# Altium project Course_Work_LM317.PrjPcb
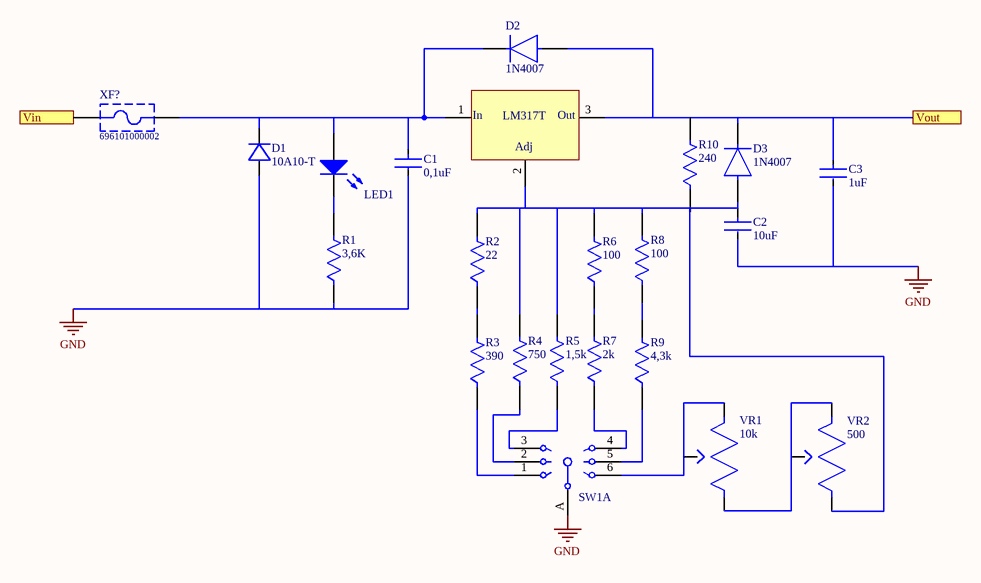
[diagram p0: Sheet1.SchDoc]
1 sheet, 22 parts. Net scope: flat (ports and power ports of the same name join across sheets).
Board file: PCB1.PcbDoc

## Sheet Sheet1.SchDoc
size A4

### Parts
*  LM317T  (value not drawn)
C1  0,1uF  [FP-CL31-IPC_C]
C2  10uF  [FP-CL31-IPC_C]
C3  1uF  [FP-CL31-IPC_B]
D1  10A10-T
D2  1N4007  [FP-1N4007-MFG]
D3  1N4007  [FP-1N4007-MFG]
LED1  150120GS75000  [1206_A]  (value not drawn)
R1  3,6K  [FP-CR1206-IPC_C]
R2  22  [FP-AC1206-MFG]
R3  390  [FP-AC1206-MFG]
R4  750  [FP-RT1206-MFG]
R5  1,5k  [FP-AC1206-MFG]
R6  100  [FP-RT1206-MFG]
R7  2k  [FP-RT1206-MFG]
R8  100  [FP-RT1206-MFG]
R9  4,3k  [FP-RT1206-MFG]
R10  240  [FP-AC1206-MFG]
SW1  A20615RNCQE  [CKCP-A20615RNCQ-14_V]  (value not drawn)  (part A of 2)
VR1  10k  [P160]
VR2  500  [P160]
XF?  696101000002  [696101000002]

### Ports
Vin (in), Vout (out)

### Nets
GND: SW1.A
NetXF?_1: XF?.1 ; port Vin

Not connected (* = marked no-connect by the designer): * 1(In) 2(Adj) 3(Out); C1 1 2; C2 1 2; C3 1 2; D1 0 1; D2 1(C) 2(A); D3 1(C) 2(A); LED1 1(K) 2(A); R1 1 2; R2 1 2; R3 1 2; R4 1 2; R5 1 2; R6 1 2; R7 1 2; R8 1 2; R9 1 2; R10 1 2; SW1 1 2 3 4 5 6; VR1 1 2 3; VR2 1 2 3; XF? 2

### Notes on the sheet
- Labels drawn without touching a wire or pin: GND

### Library data of the parts
* = LM317T: IC REG LIN POS ADJ 1.5A TO220AB; Manufacturer: ON Semiconductor / Fairchild; Number of Outputs: 1; Output Voltage: 37V; Polarity: Positive; Output Type: Adjustable; Max Input Voltage: 40V; Min Input Voltage: 4.2V; Min Output Voltage: 1.2V; Reference Voltage: 1.3V; Power Supply Rejection Ratio (PSRR): 60dB; Dropout Voltage: 2V; Power Rating: 20W; Supplier 1: Avnet; Manufacturer Part Number: LM317T; RoHS: Yes; Category: Voltage Regulators - Linear; Stock 1: 199474; Pricing 1: 331=1,07281, 340=1,05770, 670=1,02748, 1700=1,00482, 3400=0,96704, 17000=0,94438, 34000=0,92171 (USD); Mount: Through Hole; Case/Package: TO-220; Number of Pins: 3; Weight: 0.042823oz; Contact Plating: Tin,Matte; Min Operating Temperature: 0°C; Max Operating Temperature: 125°C; Output Current: 1.5A; Packaging: Rail/Tube; Max Output Current: 1.5A; Package Quantity: 50; Max Output Voltage: 37V; Number of Regulators: 1; Min Current Limit: 1.5A; Max Power Dissipation: 20W; Length: 10.67mm; Width: 4.83mm; Height: 9.4mm; Radiation Hardening: No; RoHS Compliant: Yes; REACH SVHC: No SVHC; Lead Free: Lead Free; ComponentLink1URL: https://datasheet.ciiva.com/4882/lm317-64104-4882145.pdf?src-supplier=Mouser; ComponentLink1Description: https://datasheet.ciiva.com/4882/lm317-64104-4882145.pdf?src-supplier=Mouser; ComponentLink2URL: https://datasheet.ciiva.com/2070/lm317-d-2070714.pdf?src-supplier=Digi-Key; ComponentLink2Description: https://datasheet.ciiva.com/2070/lm317-d-2070714.pdf?src-supplier=Digi-Key; Supplier Part Number 1: LM317T
C1 = CMP-13271-001731-1: Cap Ceramic 100nF 50V X7R ±10% SMD 1206 +125°C Embossed T/R; Voltage: 50V; Thickness: 0.037inch; Lead Free: Lead Free; Length: 3.2mm; Min Operating Temperature: -55°C; Package Quantity: 15000; Packaging: Tape and Reel; Mount: Surface Mount; Depth: 1.6mm; Case/Package: 1206; Voltage Rating (DC): 50V; Tolerance: 10%; Height: 0.85mm; Capacitance: 100nF; Radiation Hardening: No; Dielectric: X7R; Voltage Rating: 50V; Max Operating Temperature: 125°C; Width: 0.063inch
C2 = CMP-13271-000016-1: CAP CER 10UF 50V X5R 1206; Manufacturer: Samsung; Manufacturer Part Number: CL31A106KBHNNNE; Tolerance: 10%; Material: Ceramic; Temperature Coefficient: 15%; RoHS: TRUE; Ipc Land Pattern Name: CAPC320160X160; Temperature Range Low: -55°C; Value: 10uF; Device Class L3: Ceramic Capacitors; Category: Cap; Temperature Characteristic: X5R; Lead Free: Yes; Device Class L2: Capacitors; Octopart: https://octopart.com/cl31a106kbhnnne-samsung-19832778; ComponentLink2Description: Datasheet; Digikey Description: CAP CER 10UF 50V X5R 1206; Voltage: 50V; ComponentLink2URL: http://www.samsungsem.com/kr/support/product-search/mlcc/__icsFiles/afieldfile/2018/06/21/CL31A106KBHNNNE.pdf; Capacitance: 10uF; Temperature Range High: +85°C; Device Class L1: Passive Components; Height: 1.8mm; Automotive: No; Voltage Rating: 50V; Package: CL31; Temperature: -55°C to +85°C
C3 = CMP-13271-001662-1: Cap Ceramic 1uF 50V X7R ±10% SMD 1206 +125°C Embossed T/R; Case Code (Metric): 3216; Packaging: Tape and Reel; Depth: 1.6mm; Max Operating Temperature: 125°C; Length: 3.2mm; Contact Plating: Tin; Voltage Rating (DC): 50V; Radiation Hardening: No; Min Operating Temperature: -55°C; Dielectric: X7R; Voltage: 50V; Lead Free: Lead Free; Capacitance: 1uF; Package Quantity: 1; Material: Ceramic; Thickness: 0.071inch; Width: 0.063inch; Voltage Rating: 50V; Case Code (Imperial): 1206; Mount: Surface Mount; Case/Package: 1206; Tolerance: 10%; Height: 1.6mm
D1 = 10A10-T: Rectifiers Silicon Rectifier R6,10A,1000V; Manufacturer: Rectron; Element Configuration: Single; Max Surge Current: 400A; Max Reverse Current: 10uA; Reverse Voltage: 1kV; Forward Voltage: 1.1V; Supplier 1: Arrow Electronics; Manufacturer Part Number: 10A10-T; RoHS: Yes; Category: Rectifier Diodes; Stock 1: 2; Pricing 1: 1=0,32310, 800=0,36890, 6400=0,10300, 6400=0,10970 (USD); Case/Package: R; Weight: 0.074075oz; Min Operating Temperature: -55°C; Max Operating Temperature: 150°C; Packaging: Tape and Reel; Package Quantity: 800; Series: 10A; Reverse Voltage (DC): 1kV; Forward Current: 10A; Length: 9.1mm; Width: 9.1mm; Height: 9.1mm; RoHS Compliant: Yes; ComponentLink1URL: http://www.mouser.com/ds/2/345/10a05-10a10-16323.pdf?src-supplier=Mouser; ComponentLink1Description: http://www.mouser.com/ds/2/345/10a05-10a10-16323.pdf?src-supplier=Mouser; ComponentLink2URL: http://www.rectron.com/data_sheets/10a05-10a10.pdf?src-supplier=Mouser; ComponentLink2Description: http://www.rectron.com/data_sheets/10a05-10a10.pdf?src-supplier=Mouser; Supplier Part Number 1: 10A10-T
D2 D3 = CMP-123542-000001-1: Rectifier diode 1000 V 1 A DO-41, ,; Manufacturer: Diotec; Max Surge Forward Current: 27A; Forward Current: 1A; Max Junction Temp: +175°C; Reverse Voltage: 1000V; Value: 15pF; Peak Reverse Current: 5uA; Category: Diode; Temperature Range Low: -50°C; Automotive: No; Temperature: -50°C to +175°C; Lead Free: Yes; ComponentLink2Description: Datasheet; Max Repetitive Reverse Voltage: 1000V; ComponentLink2URL: https://datasheet.octopart.com/1N4007-Diotec-datasheet-62346875.pdf; Manufacturer Part Number: 1N4007; Device Class L3: Rectifier Diodes; Height: 2.8mm; Octopart: https://octopart.com/1n4007-diotec-4040411; Package: 1N4007; Temperature Range High: +175°C; Device Class L1: Discrete Semiconductors; Device Class L2: Diodes; RoHS: TRUE; Capacitance: 15pF; Ipc Land Pattern Name: DIOAD888W100L520D280
LED1 = CMP-1426-00014-1: SMD mono-color Chip LED, WL-SMCW, Green; Manufacturer: Wuerth Elektronik; PackageReference: 1206_A; PartNumber: 150120GS75000; ComponentLink1Description: Manufacturer URL; ComponentLink2URL: http://katalog.we-online.com/led/datasheet/150120GS75000.pdf; ComponentLink2Description: Datasheet; Color: Green; ComponentLink1URL: http://www.we-online.com
R1 = CMP-07231-000958-1: Thick Film Chip Resistors 1206 3.6kΩ 0.25W 5% 200ppm/°C; Power Rating: 250mW; Voltage Rating: 200V; Resistance: 3.6kR; Composition: Thick Film; Number of Terminations: 2; Temperature Coefficient: 200ppm/°C; Depth: 1.6mm; Features: Moisture Resistant; Case/Package: 1206; Width: 1.6mm; Case Code (Imperial): 1206; Max Power Dissipation: 250mW; Military Standard: Not; Packaging: Tape and Reel; Height: 0.03inch; Case Code (Metric): 3216; Length: 3.2mm; Radiation Hardening: No; Min Operating Temperature: -55°C; Package Quantity: 5000; Termination: SMD/SMT; Tolerance: 5%; Thickness: 610um; Contact Plating: Tin; Max Operating Temperature: 155°C; Mount: Surface Mount
R2 R3 = CMP-03412-035937-1: RES SMD 412 OHM 1% 1/4W 1206; Manufacturer: Yageo; Manufacturer Part Number: AC1206FR-07412RL; Value: 412Ω; Voltage Rating: 200V; Power Rating: 0.25W; Automotive Grade: Grade 0; Tolerance: 0.01; Temperature Range High: +155°C; Digikey Description: RES SMD 412 OHM 1% 1/4W 1206; RoHS: TRUE; Package: AC1206; Device Class L2: Resistors; Mouser Description: Thick Film Resistors - SMD 1/4W 412ohm 1% AEC-Q200; Automotive: Yes; Category: Res; Temperature: -55°C to +155°C; Temperature Range Low: -55°C; ComponentLink2URL: http://www.yageo.com/NewPortal/yageodocoutput?fileName=/pdf/R-Chip/PYu-AC_51_RoHS_L_6.pdf; Device Class L1: Passive Components; Footprint Url: http://www.yageo.com/exep/pages/download/literatures/PYu-R_Mount_10.pdf; ComponentLink2Description: Datasheet; Ipc Land Pattern Name: RESC310160X55; Series: AC; Height: 0.65mm; Device Class L3: Chip SMD Resistors; Composition: Thick Film; Resistance: 412Ω; Octopart: https://octopart.com/ac1206fr-07412rl-yageo-71368132; Lead Free: Yes
R4 = CMP-2003-04142-2: RES SMD 750K OHM 1% 1/4W 1206; Manufacturer: Yageo; Manufacturer Part Number: RT1206FRE07750KL; Voltage Rating: 200V; Temperature Coefficient: 50 ppm/°C; Resistance: 750KΩ; Tolerance: 0.0002; Power Rating: 0.25W; Value: 750KΩ; Device Class L1: Passive Components; Category: Res; Temperature Range Low: -55°C; Footprint Url: http://www.yageo.com/exep/pages/download/literatures/PYu-R_Mount_10.pdf; Ipc Land Pattern Name: RESC310160X55; Height: 0.65mm; Lead Free: Yes; Octopart: https://octopart.com/rt1206fre07750kl-yageo-1257581; ComponentLink2URL: http://www.yageo.com/documents/recent/PYu-RT_1-to-0.01_RoHS_L_9.pdf; Temperature: -55°C to +155°C; Series: RT; Temperature Range High: +155°C; Package: RT1206; ComponentLink2Description: Datasheet; Device Class L3: Chip SMD Resistors; Composition: Thin Film; Device Class L2: Resistors; RoHS: TRUE; Digikey Description: RES SMD 750K OHM 1% 1/4W 1206; Mouser Description: Thin Film Resistors - SMD 1/4W 750K ohm 1% 50ppm; Automotive: No
R5 = CMP-03412-034089-1: RES SMD 1.5K OHM 1% 1/4W 1206; Manufacturer Part Number: AC1206FR-071K5L; Manufacturer: Yageo; Tolerance: 0.01; Automotive Grade: Grade 0; Voltage Rating: 200V; Power Rating: 0.25W; Value: 1.5KΩ; Composition: Thick Film; Device Class L1: Passive Components; Device Class L2: Resistors; ComponentLink2Description: Datasheet; Automotive: Yes; Mouser Description: Thick Film Resistors - SMD 1/4W 1.5K ohm 1% AEC-Q200; Footprint Url: http://www.yageo.com/exep/pages/download/literatures/PYu-R_Mount_10.pdf; Series: AC; Category: Res; Ipc Land Pattern Name: RESC310160X55; Temperature: -55°C to +155°C; Temperature Range High: +155°C; Lead Free: Yes; Device Class L3: Chip SMD Resistors; Digikey Description: RES SMD 1.5K OHM 1% 1/4W 1206; Height: 0.65mm; Octopart: https://octopart.com/ac1206fr-071k5l-yageo-30511066; Package: AC1206; Temperature Range Low: -55°C; Resistance: 1.5KΩ; ComponentLink2URL: http://www.yageo.com/NewPortal/yageodocoutput?fileName=/pdf/R-Chip/PYu-AC_51_RoHS_L_6.pdf; RoHS: TRUE
R6 R8 = CMP-03412-001356-1: RES 100 OHM 1/4W 1% SMD 1206; Manufacturer Part Number: RT1206FRE07100RL; Manufacturer: Yageo; Resistance: 100Ω; Value: 100Ω; Tolerance: 0.0002; Power Rating: 0.25W; Voltage Rating: 200V; Temperature Coefficient: 50 ppm/°C; RoHS: TRUE; Device Class L3: Chip SMD Resistors; ComponentLink2Description: Datasheet; Automotive: No; Mouser Description: Thin Film Resistors - SMD 1/4W 100 ohm 1% 50ppm; Temperature Range Low: -55°C; Height: 0.65mm; Ipc Land Pattern Name: RESC310160X55; Footprint Url: http://www.yageo.com/exep/pages/download/literatures/PYu-R_Mount_10.pdf; Lead Free: Yes; Package: RT1206; Series: RT; Octopart: https://octopart.com/rt1206fre07100rl-yageo-1239359; Digikey Description: RES 100 OHM 1/4W 1% SMD 1206; Temperature: -55°C to +155°C; Category: Res; Temperature Range High: +155°C; Device Class L2: Resistors; Composition: Thin Film; ComponentLink2URL: http://www.yageo.com/documents/recent/PYu-RT_1-to-0.01_RoHS_L_9.pdf; Device Class L1: Passive Components
R7 R9 = CMP-2003-04209-2: RES SMD 4.3K OHM 1% 1/4W 1206; Manufacturer: Yageo; Manufacturer Part Number: RT1206FRE074K3L; Power Rating: 0.25W; Voltage Rating: 200V; Tolerance: 0.0002; Value: 4.3KΩ; Temperature Coefficient: 50 ppm/°C; ComponentLink2Description: Datasheet; Height: 0.65mm; Category: Res; Octopart: https://octopart.com/rt1206fre074k3l-yageo-1287437; Series: RT; Lead Free: Yes; Temperature Range Low: -55°C; Resistance: 4.3KΩ; Package: RT1206; Temperature Range High: +155°C; Footprint Url: http://www.yageo.com/exep/pages/download/literatures/PYu-R_Mount_10.pdf; Digikey Description: RES SMD 4.3K OHM 1% 1/4W 1206; Composition: Thin Film; Device Class L3: Chip SMD Resistors; Temperature: -55°C to +155°C; Device Class L1: Passive Components; ComponentLink2URL: http://www.yageo.com/documents/recent/PYu-RT_1-to-0.01_RoHS_L_9.pdf; RoHS: TRUE; Device Class L2: Resistors; Automotive: No; Ipc Land Pattern Name: RESC310160X55
R10 = CMP-03412-020002-1: RES SMD 240K OHM 1% 1/4W 1206; Manufacturer Part Number: AC1206FR-07240KL; Manufacturer: Yageo; Value: 240KΩ; Voltage Rating: 200V; Automotive Grade: Grade 0; Power Rating: 0.25W; Tolerance: 0.01; Height: 0.65mm; Temperature Range High: +155°C; Octopart: https://octopart.com/ac1206fr-07240kl-yageo-71368047; Device Class L2: Resistors; Series: AC; Category: Res; Footprint Url: http://www.yageo.com/exep/pages/download/literatures/PYu-R_Mount_10.pdf; Lead Free: Yes; Temperature Range Low: -55°C; ComponentLink2URL: http://www.yageo.com/NewPortal/yageodocoutput?fileName=/pdf/R-Chip/PYu-AC_51_RoHS_L_6.pdf; Ipc Land Pattern Name: RESC310160X55; RoHS: TRUE; Composition: Thick Film; Automotive: Yes; Resistance: 240KΩ; Digikey Description: RES SMD 240K OHM 1% 1/4W 1206; Temperature: -55°C to +155°C; Package: AC1206; Device Class L3: Chip SMD Resistors; ComponentLink2Description: Datasheet; Device Class L1: Passive Components
SW1 = CMP-1076-00005-1: A Series Rotary Switch, 2 Poles, 6 Positions, 30 deg Angle of Throw, -30 to 85 degC, RoHS; Manufacturer: C&K Components; Pole: 2; Position: 6; Angle of Throw: 30 deg; RoHS: TRUE; ComponentLink2Description: Datasheet; PackageReference: A20615RNCQ-14; DatasheetVersion: 41821; ComponentLink1URL: http://www.ck-components.com/; PackageDescription: 14-Pin Through Hole Device, Dia 26.19 mm, Height 60.59 mm; Series: A; PartNumber: A20615RNCQE; ComponentLink3URL: http://www.ck-components.com/13397/arotary_9apr14.pdf/; ComponentLink1Description: Manufacturer URL; ComponentLink2URL: http://www.ck-components.com/13397/arotary_9apr14.pdf/; ComponentLink3Description: Package Specification; Mounting Technology: Through Hole; Temperature Range: -30 to 85 degC
VR1 VR2 = P160KN-0QC15B500K: 500k Ohm 1 Gang Linear Panel Mount Potentiometer None 1 Turn Conductive Plastic 0.2W, 1/5W PC Pins; MF: TT Electronics/BI; Value: *; Digi-Key_Part_Number: 987-1304-ND; Package: None; Digi-Key_Purchase_URL: https://www.digikey.cz/product-detail/en/tt-electronics-bi/P160KN-0QC15B500K/987-1304-ND/2408881?utm_source=snapeda&utm_medium=aggregator&utm_campaign=symbol; MP: P160KN-0QC15B500K; SnapEDA_Link: https://www.snapeda.com/parts/P160KN-0QC15B500K/TT%20Electronics/BI/view-part/903272/?ref=snap
XF? = CMP-1502-00233-1: WR-FSH Fuse Holder Blocks Fuse Holder Blocks Clip Cover for PCB; Manufacturer: Wurth Elektronik; Fuse Size: 5x20mm; Mounting Technology: THT; Datasheet URL: https://katalog.we-online.de/em/datasheet/696101000002.pdf; Operating Temperature: -30to120degC; Packaging: Box; Publisher: WurthElektronik; Manufacturer URL: http://www.we-online.de; Part Number: 696101000002; Package Reference: 696101000002